# Altium schematic sheet HumFlex3_mech.SchDoc
size A4; SheetNumber: 3; SheetTotal: 3
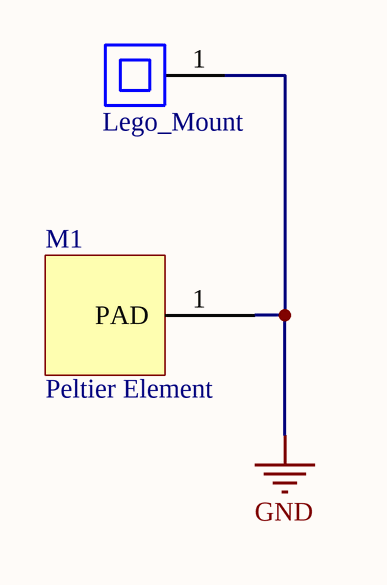
[diagram p0: HumFlex3_mech.SchDoc]

## Parts
M1  Peltier Element  [PeltierElement2]
M6  Lego_Mount  [Lego_Mount]

## Nets
GND: M1.1(PAD) M6.1

## Library data of the parts
M1 = PeltierElement: Peltier element 40mm x 40mm